# Altium schematic sheet CruxOne_v1.2.SchDoc
size 381 x 177 mm
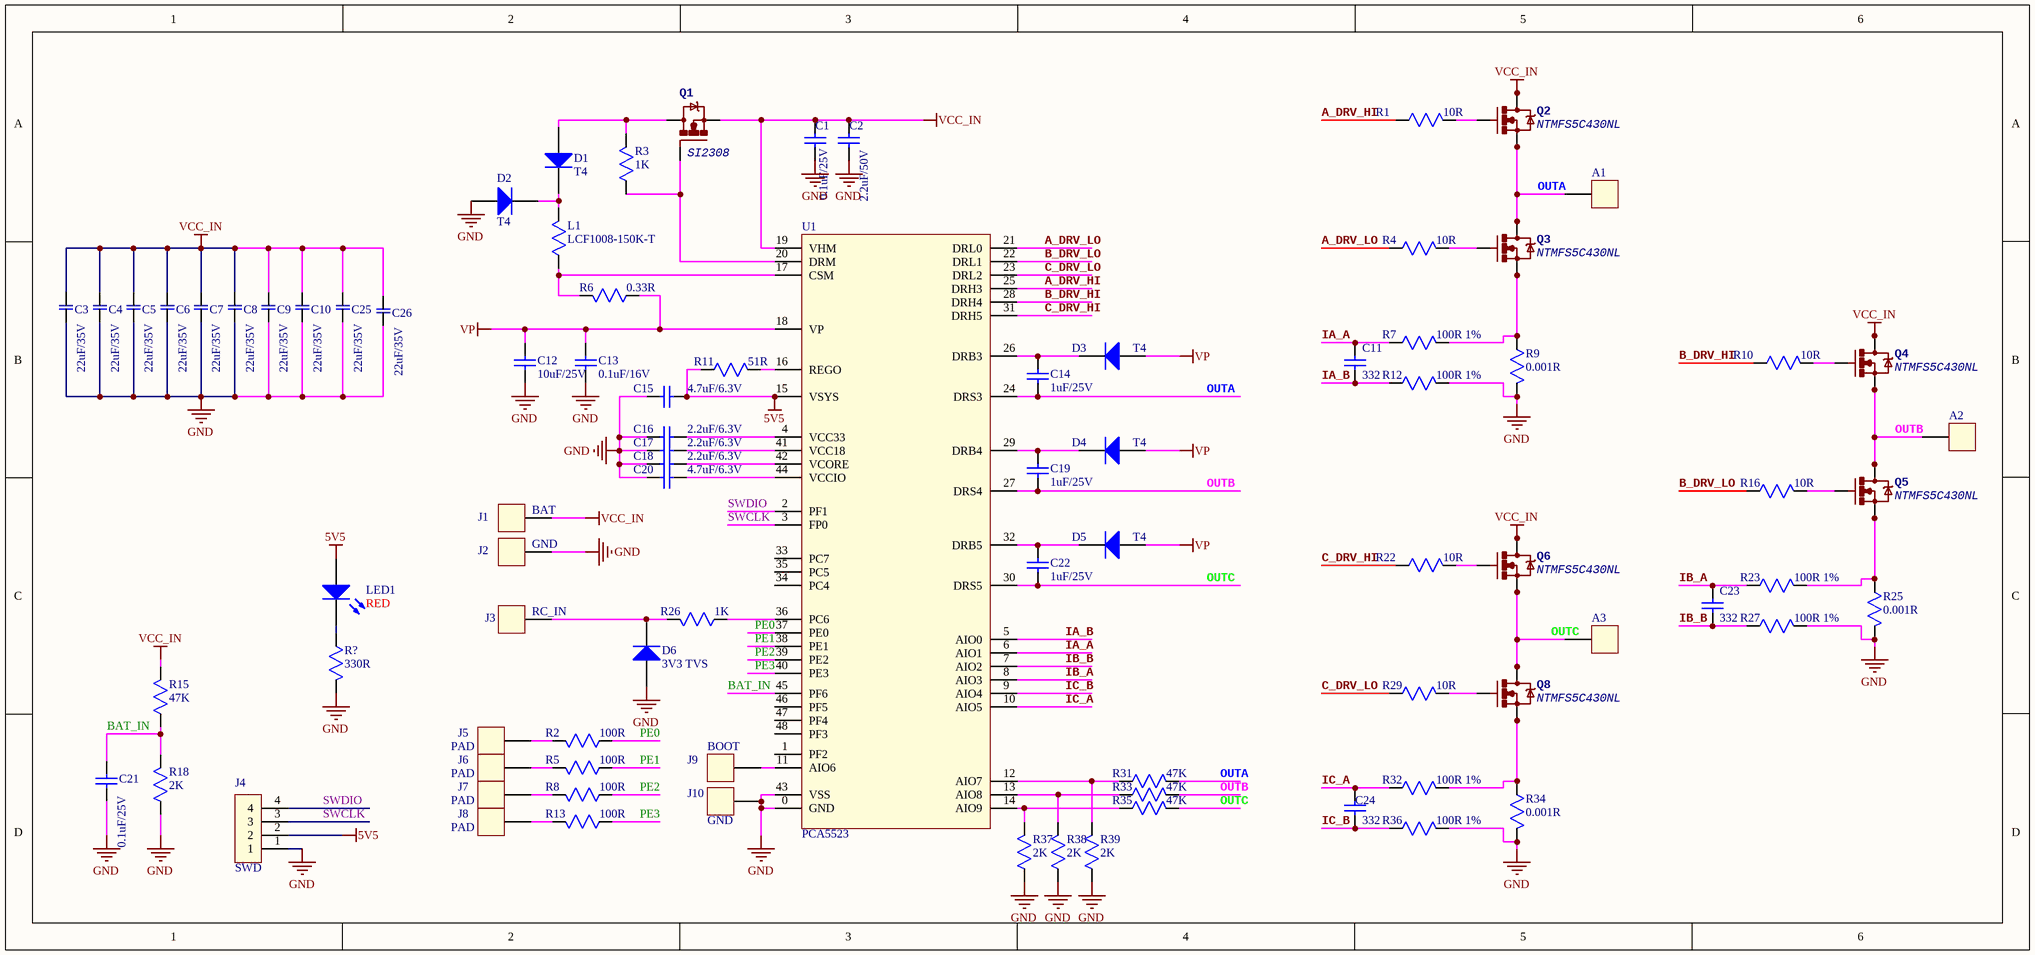
[diagram p0: CruxOne_v1.2.SchDoc]

## Parts
A1  (no value)  [PAD-1  4*3]
A2  (no value)  [PAD-1  4*3]
A3  (no value)  [PAD-1  4*3]
C1  0.1uF/25V  [0603-RES]
C2  2.2uF/50V  [0805-RES]
C3  22uF/35V  [1206-RES]
C4  22uF/35V  [1206-RES]
C5  22uF/35V  [1206-RES]
C6  22uF/35V  [1206-RES]
C7  22uF/35V  [1206-RES]
C8  22uF/35V  [1206-RES]
C9  22uF/35V  [1206-RES]
C10  22uF/35V  [1206-RES]
C11  332  [0402-RES]
C12  10uF/25V  [0805-RES]
C13  0.1uF/16V  [0402-RES]
C14  1uF/25V  [0805-RES]
C15  4.7uF/6.3V  [0402-RES]
C16  2.2uF/6.3V  [0402-RES]
C17  2.2uF/6.3V  [0402-RES]
C18  2.2uF/6.3V  [0402-RES]
C19  1uF/25V  [0805-RES]
C20  4.7uF/6.3V  [0402-RES]
C21  0.1uF/25V  [0402-RES]
C22  1uF/25V  [0805-RES]
C23  332  [0402-RES]
C24  332  [0402-RES]
C25  22uF/35V  [1206-RES]
C26  22uF/35V  [1206-RES]
D1  T4  [SOD323]
D2  T4  [SOD323]
D3  T4  [SOD323]
D4  T4  [SOD323]
D5  T4  [SOD323]
D6  3V3 TVS  [SOD323]
J1  BAT  [PAD-1  4*3]
J2  GND  [PAD-1  4*3]
J3  RC_IN  [PAD-1  2*1.5]
J4  SWD  [1.0-4p]
J5  PAD  [PAD-1  0.8*1.2]
J6  PAD  [PAD-1  0.8*1.2]
J7  PAD  [PAD-1  0.8*1.2]
J8  PAD  [PAD-1  0.8*1.2]
J9  BOOT  [PAD-1  1*1.5]
J10  GND  [PAD-1  1*1.5]
L1  LCF1008-150K-T  [LCF1008-RES]
LED1  RED  [0402-LED]
Q1  SI2308  [SOT-23]
Q2  NTMFS5C430NL  [DFN5*6]
Q3  NTMFS5C430NL  [DFN5*6]
Q4  NTMFS5C430NL  [DFN5*6]
Q5  NTMFS5C430NL  [DFN5*6]
Q6  NTMFS5C430NL  [DFN5*6]
Q8  NTMFS5C430NL  [DFN5*6]
R1  10R  [0402-RES]
R2  100R  [0402-RES]
R3  1K  [0402-RES]
R4  10R  [0402-RES]
R5  100R  [0402-RES]
R6  0.33R  [0805-RES]
R7  100R 1%  [0402-RES]
R8  100R  [0402-RES]
R9  0.001R  [2512-RES]
R10  10R  [0402-RES]
R11  51R  [0402-RES]
R12  100R 1%  [0402-RES]
R13  100R  [0402-RES]
R15  47K  [0402-RES]
R16  10R  [0402-RES]
R18  2K  [0402-RES]
R22  10R  [0402-RES]
R23  100R 1%  [0402-RES]
R25  0.001R  [2512-RES]
R26  1K  [0402-RES]
R27  100R 1%  [0402-RES]
R29  10R  [0402-RES]
R31  47K  [0402-RES]
R32  100R 1%  [0402-RES]
R33  47K  [0402-RES]
R34  0.001R  [2512-RES]
R35  47K  [0402-RES]
R36  100R 1%  [0402-RES]
R37  2K  [0402-RES]
R38  2K  [0402-RES]
R39  2K  [0402-RES]
R?  330R  [0402-CAP]
U1  PCA5523  [QFN48]

## Nets
5V5: C15.2 J4.2 LED1.1 R11.1 U1.15(VSYS)
GND: C1.2 C2.2 C3.2 C4.2 C5.2 C6.2 C7.2 C8.2 C9.2 C10.2 C12.2 C13.2 C15.1 C16.1 C17.1 C18.1 C20.1 C21.2 C25.2 C26.2 D2.1(A) D6.1(A) J2.1 J4.1 J10.1 R9.2 R12.2 R18.1 R25.2 R27.2 R34.2 R36.2 R37.1 R38.1 R39.1 R?.2 U1.0(GND) U1.43(VSS)
VCC_IN: C1.1 C2.1 C3.1 C4.1 C5.1 C6.1 C7.1 C8.1 C9.1 C10.1 C25.1 C26.1 J1.1 Q1.2(S) Q2.5(D) Q4.5(D) Q6.5(D) R15.2 U1.19(VHM)
VP: C12.1 C13.1 D3.1(A) D4.1(A) D5.1(A) R6.1 U1.18(VP)
A_DRV_HI: R1.1 U1.25(DRH3)
A_DRV_LO: R4.1 U1.21(DRL0)
B_DRV_HI: R10.1 U1.28(DRH4)
B_DRV_LO: R16.1 U1.22(DRL1)
BAT_IN: C21.1 R15.1 R18.2 U1.45(PF6)
C_DRV_HI: R22.1 U1.31(DRH5)
C_DRV_LO: R29.1 U1.23(DRL2)
IA_A: C11.1 R7.1 U1.6(AIO1)
IA_B: C11.2 R12.1 U1.5(AIO0)
IB_A: C23.1 R23.1 U1.8(AIO3)
IB_B: C23.2 R27.1 U1.7(AIO2)
IC_A: C24.1 R32.1 U1.10(AIO5)
IC_B: C24.2 R36.1 U1.9(AIO4)
OUTA: A1.1 C14.2 Q2.3(S) Q3.5(D) R31.2 U1.24(DRS3)
OUTB: A2.1 C19.2 Q4.3(S) Q5.5(D) R33.2 U1.27(DRS4)
OUTC: A3.1 C22.2 Q6.3(S) Q8.5(D) R35.2 U1.30(DRS5)
PE0: R2.1 U1.37(PE0)
PE1: R5.1 U1.38(PE1)
PE2: R8.1 U1.39(PE2)
PE3: R13.1 U1.40(PE3)
SWCLK: J4.3 U1.3(FP0)
SWDIO: J4.4 U1.2(PF1)
NetC14_1: C14.1 D3.2(K) U1.26(DRB3)
NetC16_2: C16.2 U1.4(VCC33)
NetC17_2: C17.2 U1.41(VCC18)
NetC18_2: C18.2 U1.42(VCORE)
NetC19_1: C19.1 D4.2(K) U1.29(DRB4)
NetC20_2: C20.2 U1.44(VCCIO)
NetC22_1: C22.1 D5.2(K) U1.32(DRB5)
NetD1_1: D1.1(A) Q1.3(D) R3.2
NetD1_2: D1.2(K) D2.2(K) L1.2
NetD6_2: D6.2(K) J3.1 R26.2
NetJ5_1: J5.1 R2.2
NetJ6_1: J6.1 R5.2
NetJ7_1: J7.1 R8.2
NetJ8_1: J8.1 R13.2
NetJ9_1: J9.1 U1.11(AIO6)
NetL1_1: L1.1 R6.2 U1.17(CSM)
NetLED1_2: LED1.2 R?.1
NetQ1_1: Q1.1(G) R3.1 U1.20(DRM)
NetQ2_4: Q2.4(G) R1.2
NetQ3_3: Q3.3(S) R7.2 R9.1
NetQ3_4: Q3.4(G) R4.2
NetQ4_4: Q4.4(G) R10.2
NetQ5_3: Q5.3(S) R23.2 R25.1
NetQ5_4: Q5.4(G) R16.2
NetQ6_4: Q6.4(G) R22.2
NetQ8_3: Q8.3(S) R32.2 R34.1
NetQ8_4: Q8.4(G) R29.2
NetR11_2: R11.2 U1.16(REGO)
NetR26_1: R26.1 U1.36(PC6)
NetR31_1: R31.1 R39.2 U1.12(AIO7)
NetR33_1: R33.1 R38.2 U1.13(AIO8)
NetR35_1: R35.1 R37.2 U1.14(AIO9)

Not connected (* = marked no-connect by the designer): J4 0(GND); U1 1(PF2) 33(PC7) 34(PC4) 35(PC5) 46(PF5) 47(PF4) 48(PF3)

## Library data of the parts
A1-A3 J1-J3 J9 J10 = PAD
C1 C2 C11-C24 = Cap: Value: 22uF; Published: 8-Jun-2000; LatestRevisionDate: 17-Jul-2002; LatestRevisionNote: Re-released for DXP Platform.; PackageReference: RAD-0.3; Publisher: Altium Limited; PackageDescription: Radial Cap, Thru-Hole; 2 Leads; 0.3 in Pin Spacing
C3-C10 C25 C26 = C
D1-D6 = Diode: Published: 8-Jun-2000; LatestRevisionDate: 17-Jul-2002; LatestRevisionNote: Re-released for DXP Platform.; PackageVersion: Sep-1996; PackageReference: SMC; Publisher: Altium Limited; PackageDescription: DO-214-AB/SMC; 2 C-Bend Leads; Body 7.9 x 5.9 mm, inc. leads (LxW); Code_JEDEC: DO-214-AB
J4 = J_4P
L1 R1-R13 R15 R16 R18 R22 R23 R25-R27 R29 R31-R39 R? = R
LED1 = LED1: Published: 8-Jun-2000; LatestRevisionDate: 08-Jul-2005; LatestRevisionNote: Mech Layer 1 removed.; PackageReference: LED-1; Publisher: Altium Limited
Q1 = P-MOS
Q2-Q6 Q8 = AON7418